# EAGLE design esp_neopixel (EAGLE 8.6.3)
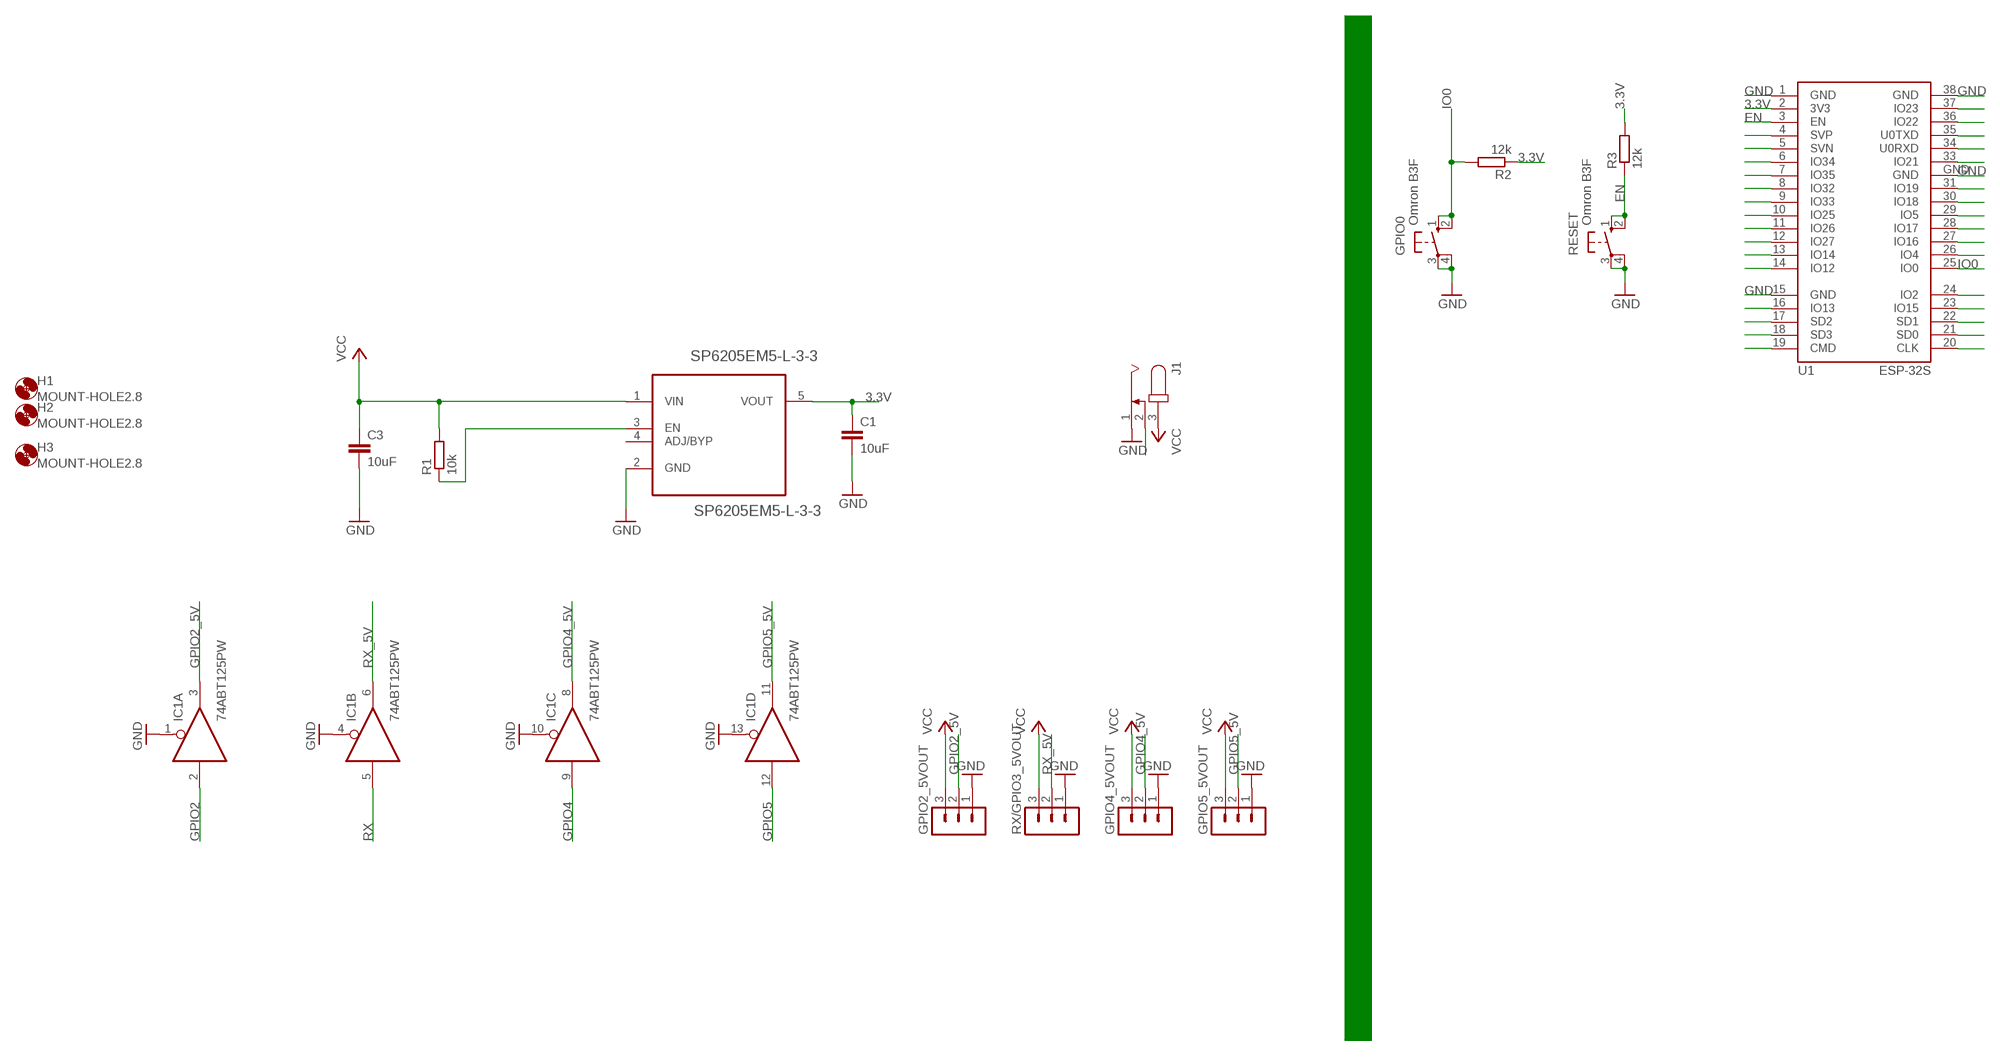
[diagram p0: schematic, sheet 1]

## Parts
C1  10uF  C-EUC0805K  [C0805K]
C3  10uF  C-EUC0805K  [C0805K]
GPIO0  Omron B3F  10-XX  [B3F-10XX]
GPIO2_5VOUT  MA03-1  [MA03-1]
GPIO4_5VOUT  MA03-1  [MA03-1]
GPIO5_5VOUT  MA03-1  [MA03-1]
H1  MOUNT-HOLE2.8  [2,8]
H2  MOUNT-HOLE2.8  [2,8]
H3  MOUNT-HOLE2.8  [2,8]
IC1  74ABT125PW  [TSSOP14]
J1  JACK-PLUG1  [SPC4078]
R1  10k  R-EU_M0805  [M0805]
R2  12k  R-EU_M0805  [M0805]
R3  12k  R-EU_M0805  [M0805]
RESET  Omron B3F  10-XX  [B3F-10XX]
RX/GPIO3_5VOUT  MA03-1  [MA03-1]
SP6205EM5-L-3-3  SP6205EM5-L-3-3  SPX3819M5-L  [SOT95P280X145-5N]
U1  ESP-32S  [ESP-32S]

## Nets
3.3V: C1.1 R2.1 R3.2 SP6205EM5-L-3-3.5(VOUT) U1.2(3V3)
EN: R3.1 RESET.1(S) RESET.2(S1) U1.3(EN)
GND: C1.2 C3.2 GPIO0.3(P) GPIO0.4(P1) GPIO2_5VOUT.1 GPIO4_5VOUT.1 GPIO5_5VOUT.1 IC1.1(A:OE) IC1.4(B:OE) IC1.10(C:OE) IC1.13(D:OE) J1.1 RESET.3(P) RESET.4(P1) RX/GPIO3_5VOUT.1 SP6205EM5-L-3-3.2(GND) U1.1(GND) U1.15(GND) U1.38(GND) U1.GND
GPIO2: IC1.2(A:I)
GPIO2_5V: GPIO2_5VOUT.2 IC1.3(A:O)
GPIO4: IC1.9(C:I)
GPIO4_5V: GPIO4_5VOUT.2 IC1.8(C:O)
GPIO5: IC1.12(D:I)
GPIO5_5V: GPIO5_5VOUT.2 IC1.11(D:O)
IO0: GPIO0.1(S) GPIO0.2(S1) R2.2 U1.25(IO0)
N$1: U1.19(CMD)
N$2: R1.1 SP6205EM5-L-3-3.3(EN)
N$3: J1.2
N$6: U1.4(SVP)
N$7: U1.5(SVN)
N$8: U1.6(IO34)
N$9: U1.7(IO35)
N$10: U1.8(IO32)
N$11: U1.9(IO33)
N$12: U1.10(IO25)
N$13: U1.11(IO26)
N$14: U1.12(IO27)
N$15: U1.13(IO14)
N$16: U1.14(IO12)
N$17: U1.16(IO13)
N$18: U1.17(SD2)
N$19: U1.18(SD3)
N$20: U1.20(CLK)
N$21: U1.21(SD0)
N$22: U1.22(SD1)
N$23: U1.23(IO15)
N$24: U1.24(IO2)
N$26: U1.26(IO4)
N$27: U1.27(IO16)
N$28: U1.28(IO17)
N$29: U1.29(IO5)
N$30: U1.30(IO18)
N$31: U1.31(IO19)
N$32: U1.33(IO21)
N$33: U1.34(U0RXD)
N$34: U1.35(U0TXD)
N$35: U1.36(IO22)
N$36: U1.37(IO23)
RX: IC1.5(B:I)
RX_5V: IC1.6(B:O) RX/GPIO3_5VOUT.2
VCC: C3.1 GPIO2_5VOUT.3 GPIO4_5VOUT.3 GPIO5_5VOUT.3 J1.3 R1.2 RX/GPIO3_5VOUT.3 SP6205EM5-L-3-3.1(VIN)
Unconnected: SP6205EM5-L-3-3.4(ADJ/BYP)

## Power pins joined to a net without a drawn wire
GND: IC1.7(P:GND)
VCC: IC1.14(P:VCC)

## Library data of the parts
C1 C3 = rcl:C-EU: CAPACITOR, European symbol
GPIO0 RESET = switch-omron:10-XX: OMRON SWITCH; MPN: B3F-1000; OC_FARNELL: 176432; OC_NEWARK: 36M3542
GPIO2_5VOUT GPIO4_5VOUT GPIO5_5VOUT RX/GPIO3_5VOUT = con-lstb:MA03-1: PIN HEADER; OC_FARNELL: unknown; OC_NEWARK: unknown
H1-H3 = holes:MOUNT-HOLE: MOUNTING HOLE with drill center marker
IC1 = 74xx-eu:74*125: Quad bus BUFFER, 3-state
J1 = con-jack:JACK-PLUG: DC POWER JACK Power Jack, DC, Right Angle, Through Hole, Rated 5A at 16VDC, PC Terminals Distributor: Farnell (www.Farnell.de) Drawing: 84N1161.pdf / 84N1162.pdf Manufacturer: SPC Technology (www.spctechnology.com) Type: SPC4077 / SPC 4078; OC_FARNELL: unknown; OC_NEWARK: unknown
R1-R3 = rcl:R-EU_: RESISTOR, European symbol
SP6205EM5-L-3-3 = Exar_By_element14_Batch_1:SPX3819M5-L: 500mA, LOW-NOISE LDO VOLTAGE REGULATOR; MPN: SPX3819M5-L; OC_FARNELL: 1831948; OC_NEWARK: 23R9689; PACKAGE: SOT-23-5; SUPPLIER: EXAR
U1 = esp32:ESP-32S: Ai-Thinker ESP-32S

## Net classes
0 default: clearance 0.205 mm

## Board
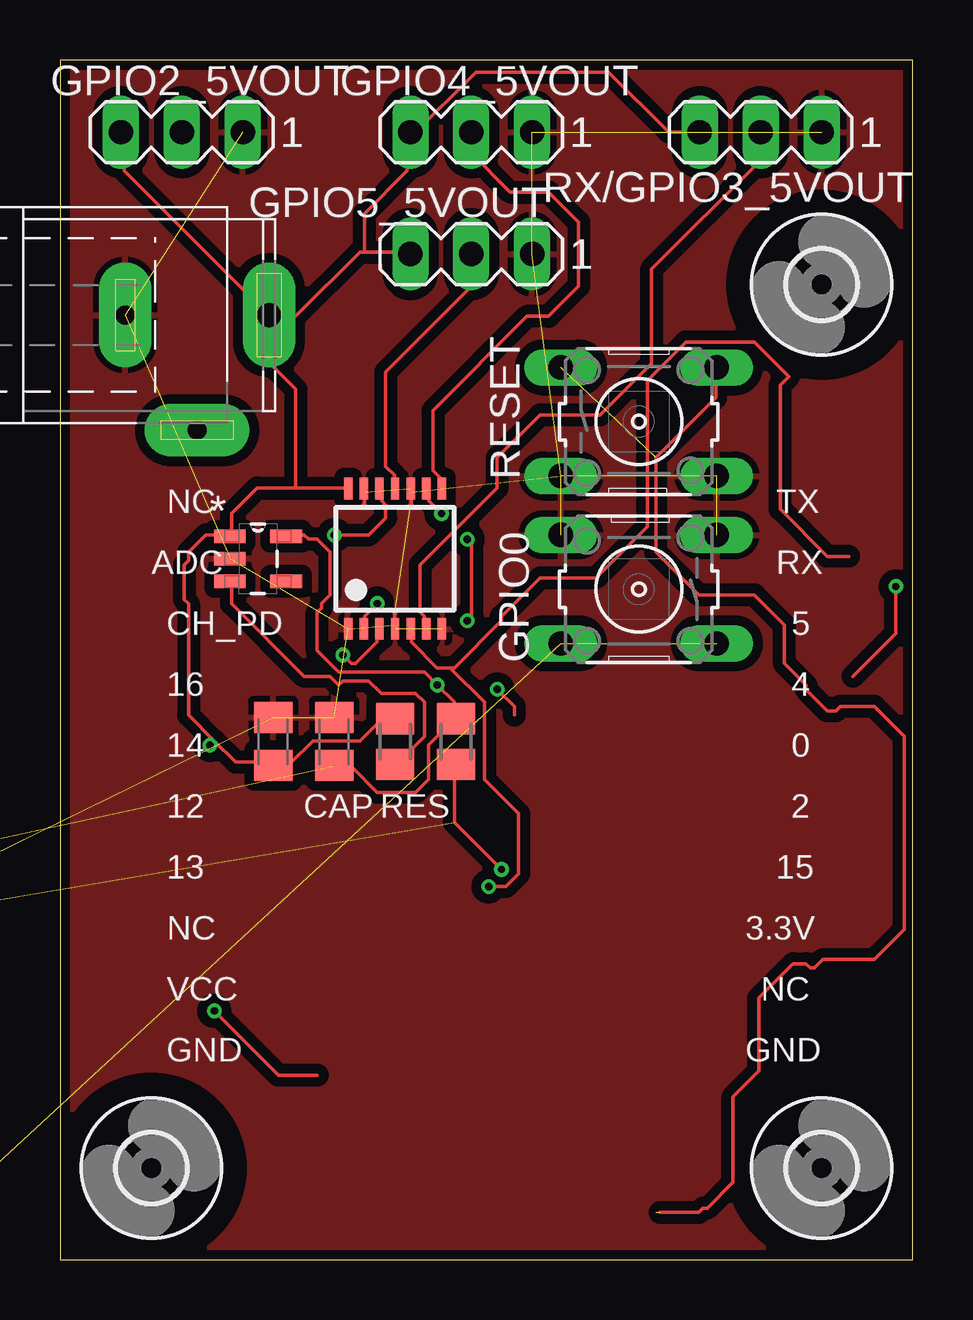
[diagram p1: board, top side]
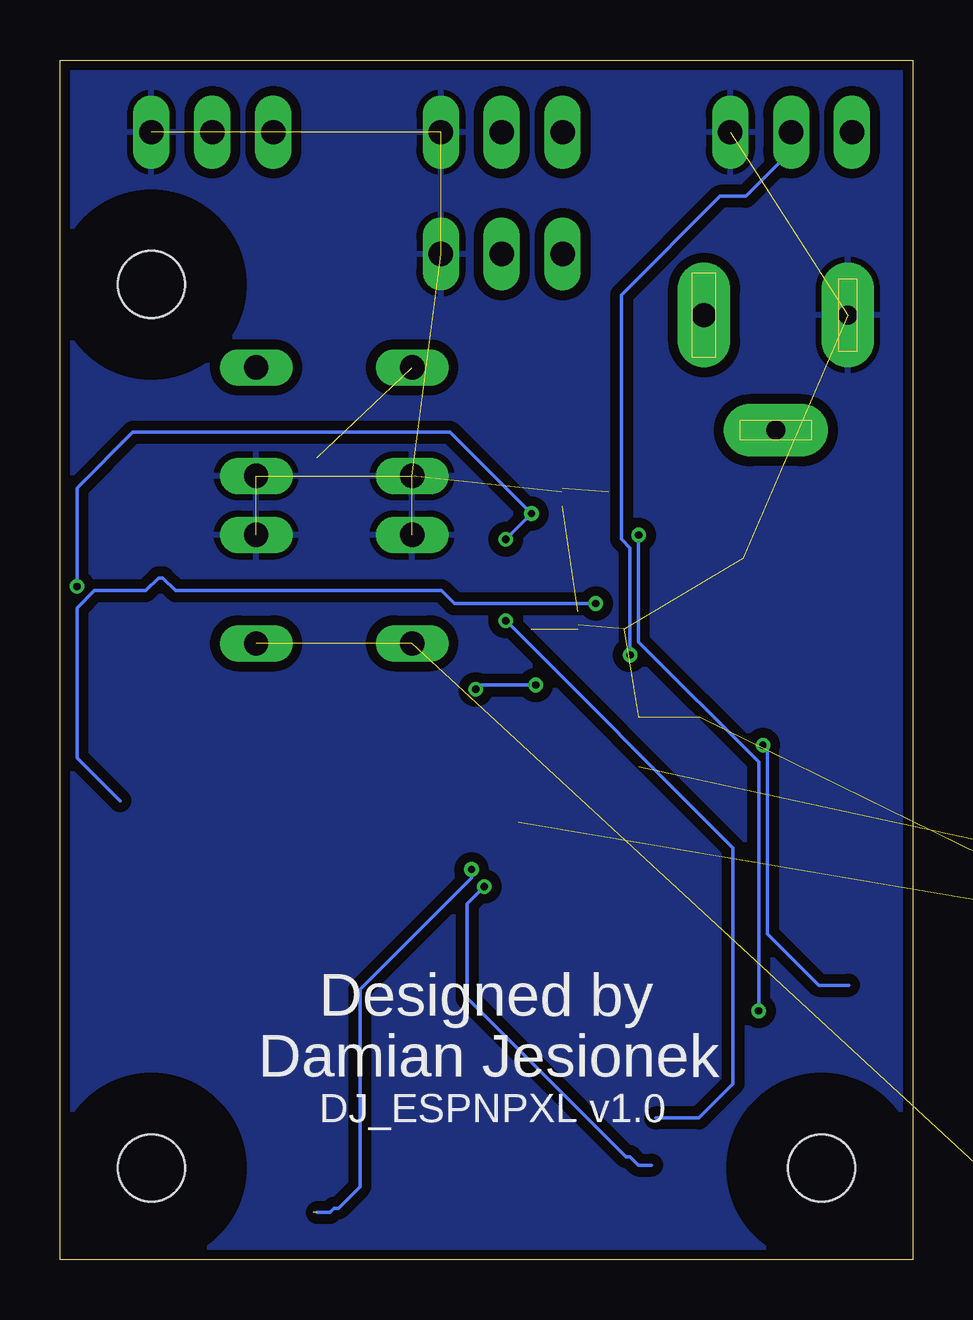
[diagram p2: board, bottom side, seen from below]

Size 35.56 x 50 mm. Coordinates in mm from the lower left corner, seen from the top.
Outline: 0,0 35.56,0 35.56,50 0,50 0,0
Copper layers (1*16): Top 0.035mm / dielectric 1.5mm / Bottom 0.035mm
Design rules "SeeedStudio_2layer_DRU_no_angle_20140221": minimum track width 6mil, minimum drill 12mil, track to track 6mil, track to pad 6mil, pad to pad 6mil, via to via 6mil, smd to smd 0mil, copper to edge 10mil, drill to drill 10mil, minimum pad ring 10mil, minimum via ring 6mil, stop-mask expansion 2mil, vias tented up to drill 100mil, thermal gap 10mil

### Footprints (pad centres in the part's own frame; a part is rotated, then mirrored left to right if it is on the bottom)
C0805K = smd 1.3 x 1.6: 1 -1,0; 2 1,0
B3F-10XX = drill 1.016 long: 1 -3.251,2.261; 2 3.251,2.261; 3 -3.251,-2.261; 4 3.251,-2.261
MA03-1 = drill 1.016 long: 1 -2.54,0; 2 0,0; 3 2.54,0
2,8 = hole 2.8: 0,0
TSSOP14 = smd 0.35 x 0.9: 1 -1.95,-2.925; 2 -1.3,-2.925; 3 -0.65,-2.925; 4 0,-2.925; 5 0.65,-2.925; 6 1.3,-2.925; 7 1.95,-2.925; 8 1.95,2.925; 9 1.3,2.925; 10 0.65,2.925; 11 0,2.925; 12 -0.65,2.925; 13 -1.3,2.925; 14 -1.95,2.925
SPC4078 = drill 0.8 pad 2.184 long: 1 -3,0; 2 0,-4.8 | drill 1 pad 2.184 long: 3 3,0
M0805 = smd 1.3 x 1.6: 1 -0.95,0; 2 0.95,0
SOT95P280X145-5N = smd 1.321 x 0.559: 1 -1.168,0.94; 2 -1.168,0; 3 -1.168,-0.94; 4 1.168,-0.94; 5 1.168,0.94
ESP-32S = smd 1.5 x 1: 1 -9.25,7; 2 -9.25,5.73; 3 -9.25,4.46; 4 -9.25,3.19; 5 -9.25,1.92; 6 -9.25,0.65; 7 -9.25,-0.62; 8 -9.25,-1.89; 9 -9.25,-3.16; 10 -9.25,-4.43; 11 -9.25,-5.7; 12 -9.25,-6.97; 13 -9.25,-8.24; 14 -9.25,-9.51; 25 9.25,-9.51; 26 9.25,-8.24; 27 9.25,-6.97; 28 9.25,-5.7; 29 9.25,-4.43; 30 9.25,-3.16; 31 9.25,-1.89; 32 9.25,-0.62; 33 9.25,0.65; 34 9.25,1.92; 35 9.25,3.19; 36 9.25,4.46; 37 9.25,5.73; 38 9.25,7 | smd 1 x 1.5: 15 -5.7,-11.25; 16 -4.43,-11.25; 17 -3.16,-11.25; 18 -1.89,-11.25; 19 -0.62,-11.25; 20 0.65,-11.25; 21 1.92,-11.25; 22 3.19,-11.25; 23 4.46,-11.25; 24 5.73,-11.25 | smd 4.5 x 4.5: GND 0.68,-0.33

### Placement (x,y rotation side)
C1  11.43,21.59 90 top
C3  8.89,21.59 90 top
GPIO0  24.13,27.94 180 top
GPIO2_5VOUT  5.08,46.99 180 top
GPIO4_5VOUT  17.14,46.99 180 top
GPIO5_5VOUT  17.14,41.91 180 top
H1  3.81,3.81 0 top
H2  31.75,3.81 0 top
H3  31.75,40.64 0 top
IC1  13.97,29.21 0 top
J1  5.71,39.37 0 top
R1  13.97,21.59 90 top
R2  -29,-13 0 top  (outside the outline)
R3  16.51,21.59 90 top
RESET  24.13,34.92 0 top
RX/GPIO3_5VOUT  29.21,46.99 180 top
SP6205EM5-L-3-3  8.26,29.21 0 top
U1  -20,6 0 top  (outside the outline)

### Tracks (layer width: path | path; a pad name or v marks a point on that pad's centre or on a via)
3.3V  (via drill 0.3)  (2 unrouted)
  Top 0.152: SP6205EM5-L-3-3.5 9.47,30.2 10.19,30.2 10.37,30.02 10.72,30.02 11.26,29.48 11.26,27.7 10.9,27.34 10.9,27.16 10.72,26.98 10.72,25.38 11.62,24.48 15.19,24.48 v15.73,23.95 16.44,23.23 16.44,22.7 R3.2 16.44,22.52 15.37,21.44 15.37,20.01 14.83,19.48 13.22,19.48 12.15,20.55 11.44,20.55 C1.1 | v18.23,23.77 18.94,23.05 18.94,22.7
  Bottom 0.152: v15.73,23.95 18.05,23.95 v18.23,23.77
EN  (via drill 0.3)  (3 unrouted)
  Top 0.152: v18.41,16.26 16.44,18.23 16.44,20.55 R3.1 | 25.02,1.97 26.63,1.97 26.8,2.14 26.98,2.14 28.06,3.22 28.06,6.79 29.13,7.86 29.13,10.9 30.56,12.33 31.09,12.33 31.27,12.15 31.45,12.15 31.81,12.51 33.95,12.51 35.2,13.76 35.2,21.8 33.95,23.05 32.52,23.05 32.34,22.87 31.99,22.87 31.09,23.77 31.09,23.95 30.2,24.84 30.2,26.45 28.95,27.7 26.63,27.7 24.84,29.48 24.84,33.42 27.34,35.92 27.34,37.17 RESET.2
  Bottom 0.152: v18.41,16.26 18.41,15.9 23.05,11.26 23.05,3.04 23.95,2.14 24.12,2.14 24.3,1.97 24.84,1.97
GND  (20 unrouted)
  Top 0.152: IC1.4 13.94,26.45 13.94,26.98 13.97,27.01 | IC1.13 12.69,31.99 12.69,31.45 12.67,31.41 | IC1.10 14.65,31.99 14.65,31.45 14.62,31.41
  pour Bottom (isolate 0.406): 0,0 0,50 35.56,50 35.56,0
  pour Top (isolate 0.406): 0,0 35.56,0 35.56,50 0,50
GPIO2  (via drill 0.3)
  Top 0.152: v13.22,27.34 12.69,26.8 12.69,26.45 IC1.2
  Bottom 0.152: v13.22,27.34 19.12,27.34 19.66,27.88 30.74,27.88 31.27,28.41 31.45,28.41 31.99,27.88 34.13,27.88 34.85,27.16 34.85,20.91 33.06,19.12
GPIO2_5V  (via drill 0.3)
  Top 0.152: v11.79,25.2 12.15,24.84 12.33,24.84 13.22,25.73 13.22,26.27 IC1.3
  Bottom 0.152: v11.79,25.2 11.79,29.66 12.15,30.02 12.15,40.21 8.04,44.32 6.97,44.32 5.18,46.1 5.18,46.82 GPIO2_5VOUT.2
GPIO4  (via drill 0.3)
  Top 0.152: v15.9,31.09 15.37,31.63 15.37,31.99 IC1.9 | v34.85,28.06 34.85,26.09 33.06,24.3 | v16.98,26.63 17.16,26.8 17.16,29.84 v16.98,30.02
  Bottom 0.152: v34.85,28.06 34.85,32.17 32.52,34.49 19.3,34.49 v15.9,31.09 v16.98,30.02 | 10.72,5.9 8.94,5.9 7.5,7.33 7.5,17.16 v16.98,26.63
GPIO4_5V
  Top 0.152: IC1.8 15.9,32.17 15.9,32.52 15.55,32.88 15.55,35.38 19.48,39.31 20.37,39.31 21.62,40.56 21.62,43.24 20.37,44.5 18.76,44.5 17.16,46.1 17.16,46.82 GPIO4_5VOUT.2
GPIO5  (via drill 0.3)
  Top 0.152: v11.44,30.2 12.87,30.2 13.58,30.91 13.58,31.45 13.4,31.63 13.4,31.99 IC1.12 | v6.43,10.37 9.11,7.68 10.72,7.68
  Bottom 0.152: v11.44,30.2 11.44,25.73 6.43,20.73 v6.43,10.37
GPIO5_5V
  Top 0.152: IC1.11 13.94,32.17 13.94,32.7 13.58,33.06 13.58,36.99 16.98,40.39 16.98,41.82 GPIO5_5VOUT.2
IO0  (3 unrouted)
N$2
  Top 0.152: SP6205EM5-L-3-3.3 7.15,28.23 7.15,27.34 10.19,24.3 11.26,24.3 11.62,23.95 11.79,24.12 12.87,24.12 13.4,23.59 14.83,23.59 15.19,23.23 15.19,21.8 14.12,20.73 R1.1
RX  (via drill 0.3)
  Top 0.152: 16.26,24.66 16.44,24.66 18.41,26.63 18.41,26.8 20.01,28.41 22.34,28.41 24.48,30.56 24.48,36.63 26.09,38.24 28.95,38.24 30.38,36.81 30.02,36.45 30.02,31.27 31.99,29.31 32.88,29.31 | 16.26,24.66 15.73,24.66 14.65,25.73 14.65,26.27 IC1.5 | v17.87,15.55 18.59,15.55 19.12,16.08 19.12,18.59 17.69,20.01 17.69,23.23 16.26,24.66
  Bottom 0.152: 10.9,3.93 11.44,3.93 11.79,4.29 11.97,4.29 18.59,10.9 18.59,14.83 v17.87,15.55
RX_5V
  Top 0.152: IC1.6 15.19,26.45 15.19,26.8 15.01,26.98 15.01,28.95 18.23,32.17 18.23,33.42 20.01,35.2 22.52,35.2 24.66,37.35 24.66,41.28 29.13,45.75 29.13,46.82 RX/GPIO3_5VOUT.2
VCC  (via drill 0.3)
  Top 0.152: 9.83,32.17 8.22,32.17 7.15,31.09 7.15,30.2 SP6205EM5-L-3-3.1 6.97,30.2 6.08,30.2 5.36,29.48 5.36,29.13 5.18,28.95 5.18,27.52 5.36,27.34 5.36,22.7 6.43,21.62 | 9.83,32.17 11.97,32.17 IC1.14 | 6.43,21.62 7.33,20.73 8.76,20.73 C3.1 8.94,20.73 9.65,20.73 10.54,21.62 12.51,21.62 13.4,22.52 13.94,22.52 R1.2 | 6.43,21.62 v6.25,21.44 | 12.69,41.99 12.51,41.99 9.83,39.31 8.94,39.31 | 12.69,41.99 14.47,41.99 GPIO5_5VOUT.3 | 8.94,39.31 8.76,39.31 J1.3 | GPIO2_5VOUT.3 2.68,46.82 2.68,45.39 8.58,39.49 J1.3 | 12.69,41.99 12.69,43.6 14.47,45.39 14.47,46.82 GPIO4_5VOUT.3 14.65,46.82 17.33,49.5 22.87,49.5 25.38,47 26.63,47 RX/GPIO3_5VOUT.3 | 9.83,32.17 9.83,36.28 8.94,37.17 8.94,39.31 | 8.94,39.31 J1.3
  Bottom 0.152: 2.68,11.44 3.93,11.44 6.08,13.58 6.08,21.27 v6.25,21.44

### Text on the board
tNames: NC | TX | ADC | RX | CH_PD | 5 | 16 | 4 | 14 | 0 | 12 | CAP | RES | 2 | 13 | 15 | NC | 3.3V | VCC | NC | GND | GND
bNames: Designed by | Damian Jesionek | DJ_ESPNPXL v1.0